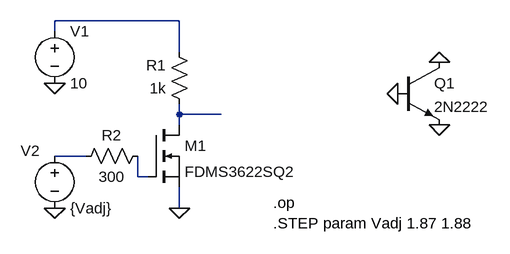
[diagram p0: schematic Draft1.asc]
Draft1.asc, the LTspice schematic file:
Version 4
SHEET 1 880 680
WIRE 192 -16 0 -16
WIRE 0 0 0 -16
WIRE 192 32 192 -16
WIRE 192 128 192 112
WIRE 256 128 192 128
WIRE 192 144 192 128
WIRE 48 192 0 192
WIRE 128 224 128 192
WIRE 144 224 128 224
WIRE 192 272 192 240
FLAG 192 272 0
FLAG 0 80 0
FLAG 0 272 0
FLAG 592 144 0
FLAG 528 96 0
FLAG 592 48 0
SYMBOL npn 528 48 R0
SYMATTR InstName Q1
SYMATTR Value 2N2222
SYMBOL res 208 128 R180
WINDOW 0 36 76 Left 2
WINDOW 3 36 40 Left 2
SYMATTR InstName R1
SYMATTR Value 1k
SYMBOL voltage 0 -16 R0
WINDOW 123 0 0 Left 2
WINDOW 39 0 0 Left 2
SYMATTR InstName V1
SYMATTR Value 10
SYMBOL res 144 176 R90
WINDOW 0 0 56 VBottom 2
WINDOW 3 32 56 VTop 2
SYMATTR InstName R2
SYMATTR Value 300
SYMBOL voltage 0 176 R0
WINDOW 0 -52 8 Left 2
WINDOW 123 0 0 Left 2
WINDOW 39 0 0 Left 2
SYMATTR InstName V2
SYMATTR Value {Vadj}
SYMBOL nmos 144 144 R0
SYMATTR InstName M1
SYMATTR Value FDMS3622SQ2
TEXT 336 264 Left 2 !.op\n.STEP param Vadj 1.87 1.88

The netlist it stands for:
* Draft1.asc
Q1 0 0 0 0 2N2222
R1 N002 N001 1k
V1 N001 0 10
R2 N004 N003 300
V2 N003 0 {Vadj}
M1 N002 N004 0 0 FDMS3622SQ2
.model NPN NPN
.model PNP PNP
.lib standard.bjt
.model NMOS NMOS
.model PMOS PMOS
.lib standard.mos
.op
.STEP param Vadj 1.87 1.88
.backanno
.end